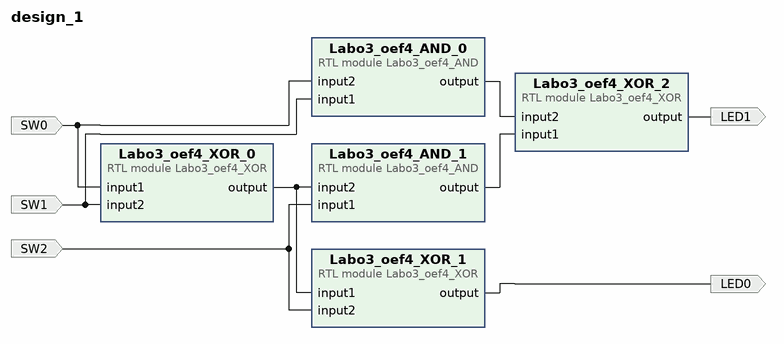
[diagram p0: block diagram of the top level]
# Vivado block design design_1, xc7z020clg400-1, Vivado 2023.1
create_bd_design design_1

create_bd_port -dir I SW0
create_bd_port -dir I SW1
create_bd_port -dir I SW2
create_bd_port -dir O LED0
create_bd_port -dir O LED1

create_bd_cell -type module -reference Labo3_oef4_AND Labo3_oef4_AND_0
create_bd_cell -type module -reference Labo3_oef4_XOR Labo3_oef4_XOR_0
create_bd_cell -type module -reference Labo3_oef4_AND Labo3_oef4_AND_1
create_bd_cell -type module -reference Labo3_oef4_XOR Labo3_oef4_XOR_1
create_bd_cell -type module -reference Labo3_oef4_XOR Labo3_oef4_XOR_2

# ---- connections ----

connect_bd_net [get_bd_pins Labo3_oef4_AND_0/output] [get_bd_pins Labo3_oef4_XOR_2/input2]
connect_bd_net [get_bd_pins Labo3_oef4_AND_1/output] [get_bd_pins Labo3_oef4_XOR_2/input1]
connect_bd_net [get_bd_pins Labo3_oef4_XOR_0/output] [get_bd_pins Labo3_oef4_AND_1/input2] [get_bd_pins Labo3_oef4_XOR_1/input1]
connect_bd_net [get_bd_pins Labo3_oef4_XOR_1/output] [get_bd_ports LED0]
connect_bd_net [get_bd_pins Labo3_oef4_XOR_2/output] [get_bd_ports LED1]
connect_bd_net -net SW0_1 [get_bd_ports SW0] [get_bd_pins Labo3_oef4_XOR_0/input1] [get_bd_pins Labo3_oef4_AND_0/input2]
connect_bd_net -net SW1_1 [get_bd_ports SW1] [get_bd_pins Labo3_oef4_XOR_0/input2] [get_bd_pins Labo3_oef4_AND_0/input1]
connect_bd_net -net SW2_1 [get_bd_ports SW2] [get_bd_pins Labo3_oef4_AND_1/input1] [get_bd_pins Labo3_oef4_XOR_1/input2]

validate_bd_design
save_bd_design
